# EAGLE design hellobusbridge_button (EAGLE 7.5.0)
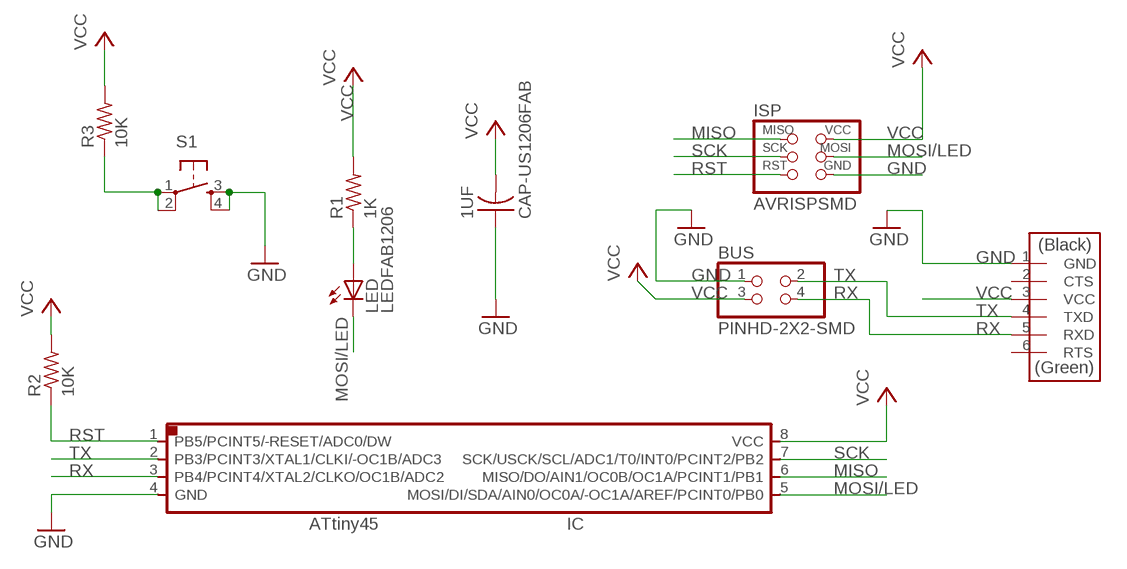
[diagram p0: schematic, sheet 1]

## Parts
1UF  CAP-US1206FAB  [C1206FAB]
BUS  PINHD-2X2-SMD  [2X02SMD]
IC  IC  ATTINY45SI  [SOIC8]
ISP  AVRISPSMD  [2X03SMD]
LED  LEDFAB1206  [LED1206FAB]
R1  1K  RES-US1206FAB  [R1206FAB]
R2  10K  RES-US1206FAB  [R1206FAB]
R3  10K  RES-US1206FAB  [R1206FAB]
S1  6MM_SWITCH6MM_SWITCH  [6MM_SWITCH]
U$5  FTDI-SMD-HEADER  [1X06SMD]

## Nets
GND: 1UF.1 BUS.1 IC.4(GND) ISP.6(GND) S1.3(S) S1.4(S1) U$5.1(GND)
MISO: IC.6(MISO/DO/AIN1/OC0B/OC1A/PCINT1/PB1) ISP.1(MISO) R3.1 S1.1(P) S1.2(P1)
MOSI/LED: IC.5(MOSI/DI/SDA/AIN0/OC0A/-OC1A/AREF/PCINT0/PB0) ISP.4(MOSI) LED.2(C)
N$1: LED.1(A) R1.1
RST: IC.1(PB5/PCINT5/-RESET/ADC0/DW) ISP.5(RST) R2.1
RX: BUS.4 IC.3(PB4/PCINT4/XTAL2/CLKO/OC1B/ADC2) U$5.5(RXD)
SCK: IC.7(SCK/USCK/SCL/ADC1/T0/INT0/PCINT2/PB2) ISP.3(SCK)
TX: BUS.2 IC.2(PB3/PCINT3/XTAL1/CLKI/-OC1B/ADC3) U$5.4(TXD)
VCC: 1UF.2 BUS.3 IC.8(VCC) ISP.2(VCC) R1.2 R2.2 R3.2 U$5.3(VCC)
Unconnected: U$5.2(CTS) U$5.6(RTS)

## Library data of the parts
1UF = fab:CAP-US
BUS = fab:PINHD-2X2-SMD
IC = fab:ATTINY45
ISP = fab:AVRISP
LED = fab:LED: LED
R1-R3 = fab:RES-US: Resistor (US Symbol) Variants with postfix FAB are widened to allow the routing of internal traces
S1 = fab:6MM_SWITCH: OMRON SWITCH
U$5 = fab:FTDI-SMD-HEADER

## Board
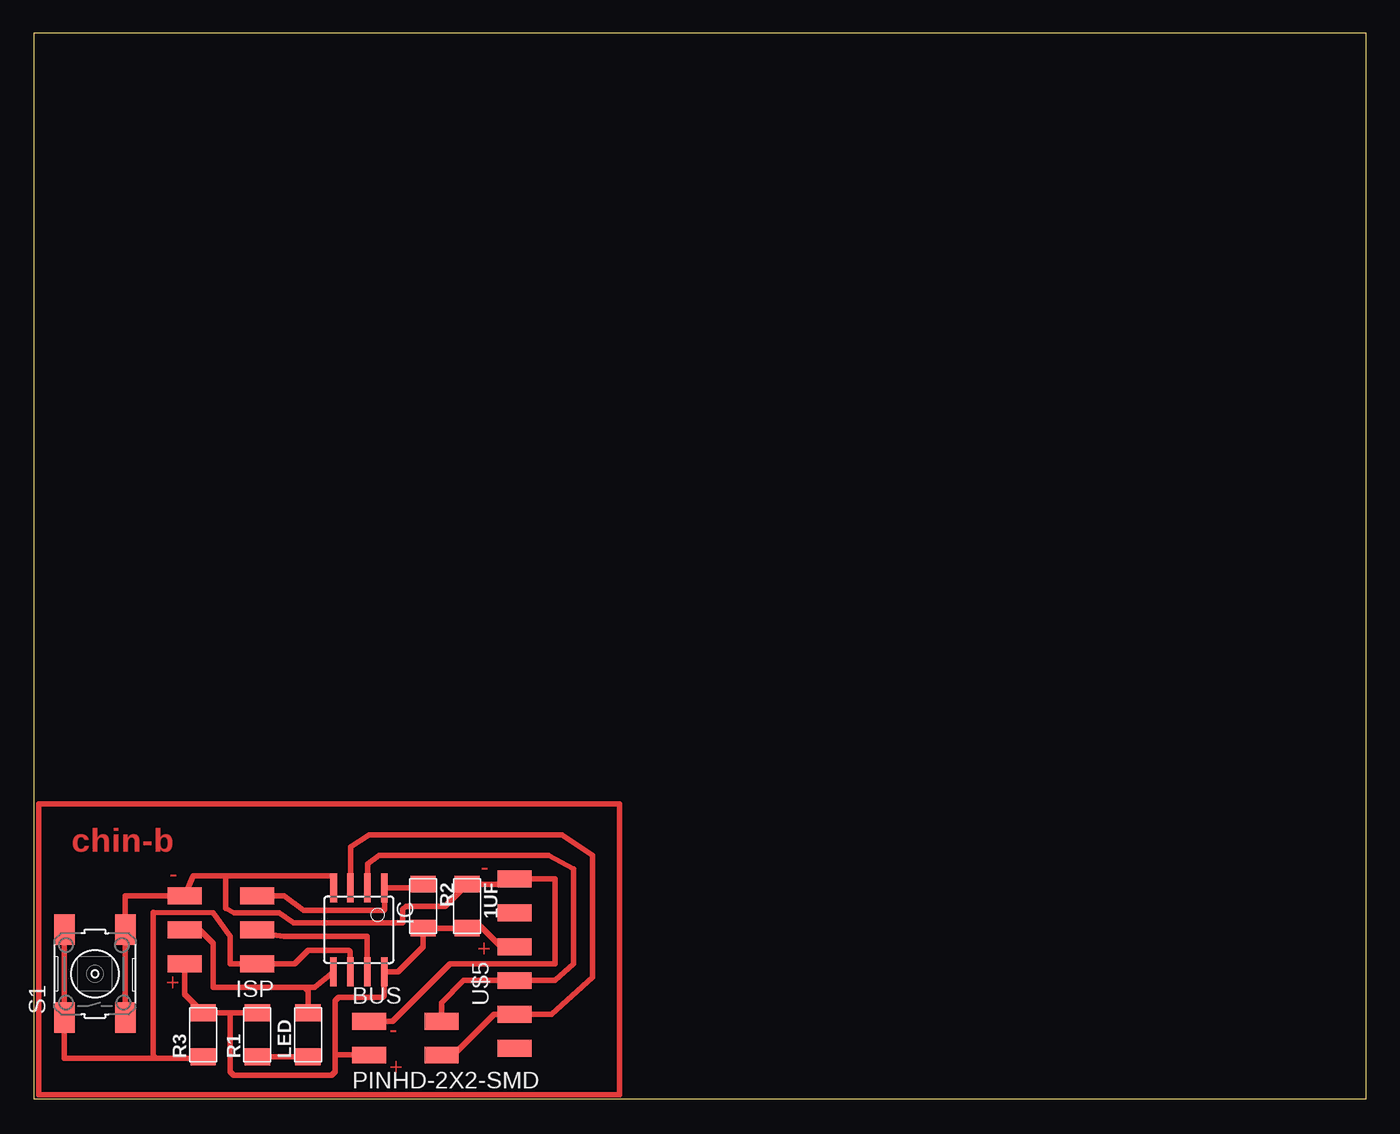
[diagram p1: board, top side]

Size 100 x 80 mm. Coordinates in mm from the lower left corner, seen from the top.
Outline: 0,0 100,0 100,80 0,80 0,0
Copper layers (1*16): Top 0.035mm / dielectric 1.5mm / Bottom 0.035mm
Design rules "default": minimum track width 10mil, minimum drill 24mil, track to track 8mil, track to pad 8mil, pad to pad 8mil, via to via 8mil, smd to smd 8mil, copper to edge 40mil, drill to drill 8mil, minimum pad ring 10mil, minimum via ring 8mil, stop-mask expansion 4mil, vias tented up to drill 0mil, thermal gap 10mil

### Footprints (pad centres in the part's own frame; a part is rotated, then mirrored left to right if it is on the bottom)
C1206FAB = smd 1.27 x 1.905: 1 -1.651,0; 2 1.651,0
2X02SMD = smd 2.54 x 1.27: 1 -2.54,1.27; 2 2.92,1.27; 3 -2.54,-1.27; 4 2.92,-1.27
SOIC8 = smd 0.5 x 2.2: 1 -1.905,-3.154; 2 -0.645,-3.154; 3 0.625,-3.154; 4 1.895,-3.154; 5 1.905,3.154; 6 0.635,3.154; 7 -0.635,3.154; 8 -1.905,3.154
2X03SMD = smd 2.54 x 1.27: 1 -2.54,2.54; 2 2.92,2.54; 3 -2.54,0; 4 2.92,0; 5 -2.54,-2.54; 6 2.92,-2.54
LED1206FAB = smd 1.27 x 1.905: 1 -1.651,0; 2 1.651,0
R1206FAB = smd 1.27 x 1.905: 1 -1.651,0; 2 1.651,0
6MM_SWITCH = smd 2.286 x 1.524: 1 -3.302,2.286; 2 3.302,2.286; 3 -3.302,-2.286; 4 3.302,-2.286
1X06SMD = smd 2.54 x 1.27: 1 0,6.35; 2 0,3.81; 3 0,1.27; 4 0,-1.27; 5 0,-3.81; 6 0,-6.35

### Placement (x,y rotation side)
1UF  32.51,14.48 270 top
BUS  27.69,4.57 0 top
IC  24.38,12.7 180 top
ISP  14.22,12.7 180 top
LED  20.57,4.83 90 top
R1  16.76,4.83 90 top
R2  29.21,14.48 270 top
R3  12.7,4.83 90 top
S1  4.57,9.4 90 top
U$5  36.07,10.16 0 top

### Tracks (layer width: path | path; a pad name or v marks a point on that pad's centre or on a via)
GND
  Top 0.254: 10.49,15.09 11.18,15.09 ISP.6
  Top 0.406: 35.69,16.51 U$5.1 | IC.4 22.49,16.37 22.48,16.76 14.4,16.76 | 14.4,16.76 11.94,16.76 ISP.6 | 14.4,16.76 14.4,14.33 15.04,13.97 18.41,13.97 19.51,13.23 27.69,13.21 27.69,14.22 27.94,14.48 30.86,14.48 1UF.1 35.69,16.13 U$5.1 | S1.3 S1.4 6.86,15.24 10.34,15.24 10.49,15.09 | BUS.1 26.92,5.84 31.24,10.16 39.12,10.16 39.12,16.51 U$5.1
MISO
  Top 0.406: IC.6 23.75,11.05 23.62,11.18 20.57,11.18 19.56,10.16 ISP.1 14.73,10.16 14.73,12.19 13.46,13.97 8.94,13.99 8.94,3.25 9.14,3.05 | S1.2 S1.1 2.29,3.05 9.14,3.05 | 9.14,3.05 12.57,3.05 R3.1
MOSI/LED
  Top 0.406: IC.5 21.06,8.38 20.32,8.38 | 20.32,8.38 13.46,8.38 13.46,11.68 12.45,12.7 ISP.4 | LED.2 20.57,8.13 20.32,8.38
N$1
  Top 0.406: R1.1 LED.1
N$2
  Top 0.406: 0.36,0.3 43.97,0.3 43.97,22.15 0.36,22.15 0.36,0.3
RST
  Top 0.406: ISP.5 18.8,15.24 20.24,14.17 26.26,14.17 26.31,14.25 26.31,15.83 IC.1 28.93,15.85 R2.1
RX
  Top 0.406: IC.3 23.76,18.93 25.15,19.81 39.62,19.81 41.91,18.29 41.91,9.14 38.86,6.35 U$5.5 34.54,6.35 31.5,3.3 BUS.4
SCK
  Top 0.406: IC.7 25.02,11.56 24.99,12.19 18.8,12.19 17.02,12.45 ISP.3
TX
  Top 0.406: IC.2 25.03,17.66 25.91,18.29 38.61,18.29 40.49,17.27 40.49,10.16 39.12,8.89 U$5.4 32.26,8.89 30.61,7.24 BUS.2
VCC
  Top 0.406: ISP.2 11.3,7.87 R3.2 14.73,6.48 | R1.2 14.73,6.48 | 22.61,3.3 22.61,7.37 22.86,7.62 26.16,7.62 26.29,7.75 IC.8 27.33,9.55 29.21,11.43 R2.2 1UF.2 32.64,12.95 33.53,12.95 35.05,11.43 U$5.3 | 22.61,3.3 22.61,2.03 22.35,1.78 14.99,1.78 14.73,2.03 14.73,6.48 | BUS.3 22.61,3.3

### Text on the board
Top: chin-b | - | - | + | + | - | +